# EAGLE design Schematic (EAGLE 6.3)
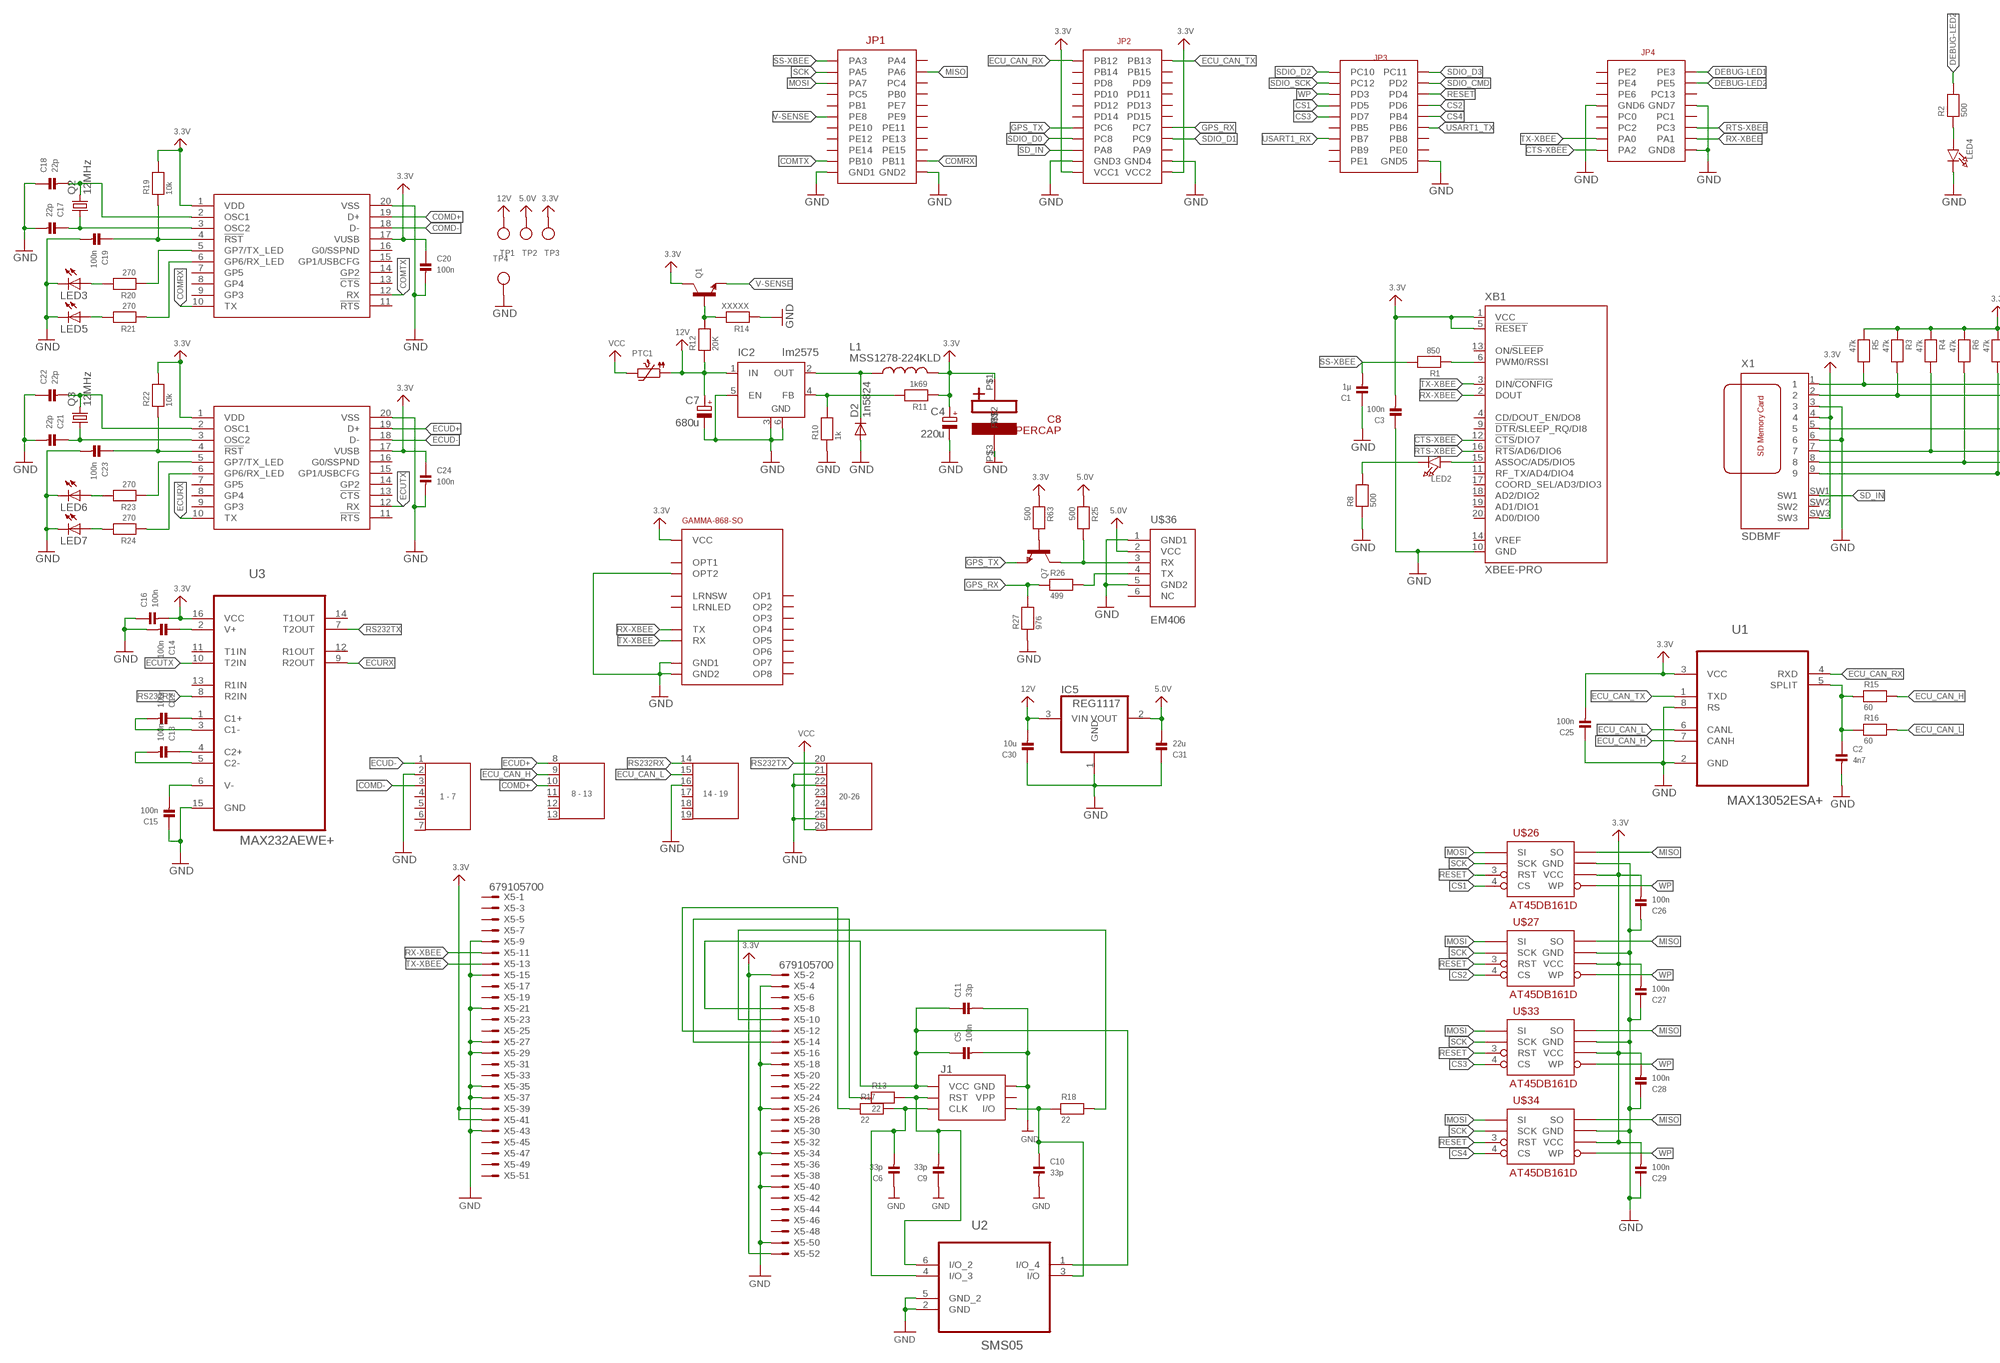
[diagram p0: schematic, sheet 1, part 1 of 2]
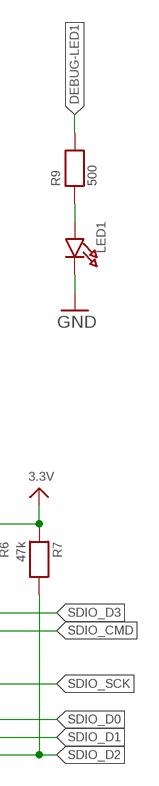
[diagram p1: schematic, sheet 1, part 2 of 2]

## Parts
C1  1µ  CAP_CERAMIC_0805  [_0805]
C2  4n7  CAP_CERAMIC0603  [0603]
C3  100n  CAP_CERAMIC_0603  [_0603]
C4  220u  CPOL-EUE3.5-8  [E3,5-8]
C5  100n  CAP_CERAMIC_0603  [_0603]
C6  33p  CAP_CERAMIC_0603  [_0603]
C7  680u  CPOL-EUE5-10.5  [E5-10,5]
C8  SUPERCAP  [SUPERCAP]
C9  33p  CAP_CERAMIC_0603  [_0603]
C10  33p  CAP_CERAMIC_0603  [_0603]
C11  33p  CAP_CERAMIC_0603  [_0603]
C12  100n  CAP_CERAMIC_0603  [_0603]
C13  100n  CAP_CERAMIC_0603  [_0603]
C14  100n  CAP_CERAMIC_0603  [_0603]
C15  100n  CAP_CERAMIC_0603  [_0603]
C16  100n  CAP_CERAMIC_0603  [_0603]
C17  22p  CAP_CERAMIC_0603  [_0603]
C18  22p  CAP_CERAMIC_0603  [_0603]
C19  100n  CAP_CERAMIC_0603  [_0603]
C20  100n  CAP_CERAMIC_0603  [_0603]
C21  22p  CAP_CERAMIC_0603  [_0603]
C22  22p  CAP_CERAMIC_0603  [_0603]
C23  100n  CAP_CERAMIC_0603  [_0603]
C24  100n  CAP_CERAMIC_0603  [_0603]
C25  100n  CAP_CERAMIC_0603  [_0603]
C26  100n  CAP_CERAMIC_0603  [_0603]
C27  100n  CAP_CERAMIC_0603  [_0603]
C28  100n  CAP_CERAMIC_0603  [_0603]
C29  100n  CAP_CERAMIC_0603  [_0603]
C30  10u  CAP_CERAMIC_0805  [_0805]
C31  22u  CAP_CERAMIC_0805  [_0805]
D2  1n5824  1N5400  [DO201-15]
IC2  lm2575  LM2596S  [TO263-5]
IC5  REG1117  [SOT223]
J1  SIMHOLDERSIM  [SIMHOLDER]
L1  MSS1278-224KLD  INDUCTORPWR  [CDRH125]
LED1  LED1206  [CHIPLED_1206]
LED2  LED1206  [CHIPLED_1206]
LED3  LEDCHIPLED_0805  [CHIPLED_0805]
LED4  LED1206  [CHIPLED_1206]
LED5  LEDCHIPLED_0805  [CHIPLED_0805]
LED6  LEDCHIPLED_0805  [CHIPLED_0805]
LED7  LEDCHIPLED_0805  [CHIPLED_0805]
PTC1  PTC1812  [PTC1812]
Q1  TRANSISTOR_NPNWIDE  [SOT23-WIDE]
Q2  12MHz  CRYSTALHC49S  [HC49/S]
Q3  12MHz  CRYSTALHC49S  [HC49/S]
Q7  TRANSISTOR_NPNWIDE  [SOT23-WIDE]
R1  850  RESISTOR_0603  [_0603]
R2  500  RESISTOR_0603  [_0603]
R3  47k  RESISTOR_0603  [_0603]
R4  47k  RESISTOR_0603  [_0603]
R5  47k  RESISTOR_0603  [_0603]
R6  47k  RESISTOR_0603  [_0603]
R7  47k  RESISTOR_0603  [_0603]
R8  500  RESISTOR_0603  [_0603]
R9  500  RESISTOR_0603  [_0603]
R10  1k  RESISTOR_0603  [_0603]
R11  1k69  RESISTOR_0603  [_0603]
R12  20K  RESISTOR_0603  [_0603]
R13  22  RESISTOR_0603  [_0603]
R14  XXXXX  RESISTOR_0603  [_0603]
R15  60  RESISTOR_0603  [_0603]
R16  60  RESISTOR_0603  [_0603]
R17  22  RESISTOR_0603  [_0603]
R18  22  RESISTOR_0603  [_0603]
R19  10k  RESISTOR_0603  [_0603]
R20  270  RESISTOR_0603  [_0603]
R21  270  RESISTOR_0603  [_0603]
R22  10k  RESISTOR_0603  [_0603]
R23  270  RESISTOR_0603  [_0603]
R24  270  RESISTOR_0603  [_0603]
R25  500  RESISTOR_0603  [_0603]
R26  499  RESISTOR_0603  [_0603]
R27  976  RESISTOR_0603  [_0603]
R63  500  RESISTOR_0603  [_0603]
TP1  TESTPOINT  [TESTPOINT_SMT]
TP2  TESTPOINT  [TESTPOINT_SMT]
TP3  TESTPOINT  [TESTPOINT_SMT]
TP4  TESTPOINT  [TESTPOINT_SMT]
U1  MAX13052ESA+  [SOIC127P600X175-8N]
U2  SMS05  [SOT95P280X145-6N]
U3  MAX232AEWE+  [SOIC127P1032X265-16N]
U$1  CPU-BOARD  [CPU-BOARD-JP1]
U$18  SUPERSEAL-26  [SUPERSEAL-26]
U$24  MCP2200  [SO20L]
U$26  AT45DB161D  [SO08-EIAJ]
U$27  AT45DB161D  [SO08-EIAJ]
U$29  MCP2200  [SO20L]
U$32  GAMMA-868-SO  [UNICORN_V2_GAMMA-868-SO]
U$33  AT45DB161D  [SO08-EIAJ]
U$34  AT45DB161D  [SO08-EIAJ]
U$36  EM406  [EM406]
X1  SDBMF  [SDBMF-009XXBXX2]
X5  679105700  [679105700]
XB1  XBEE-PRO  [XBEE-PRO]

## Nets
3.3V: C3.2 C4.+ C8.P$1 C16.2 C20.1 C24.1 C25.2 C26.2 C27.2 C28.2 C29.2 L1.2 Q1.3(C) R3.1 R4.1 R5.1 R6.1 R7.1 R11.1 R19.2 R22.2 R63.1 TP3.P$1 U1.3(VCC) U3.16(VCC) U$1.P$43(VCC1) U$1.P$44(VCC2) U$24.1(VDD) U$24.17(VUSB) U$26.6(VCC) U$27.6(VCC) U$29.1(VDD) U$29.17(VUSB) U$32.P$16(VCC) U$33.6(VCC) U$34.6(VCC) X1.4 X1.SW3 X5.2 X5.39 X5.41 X5.52 XB1.1(VCC) XB1.5(!RESET)
5.0V: C31.2 IC5.2(VOUT) R25.1 TP2.P$1 U$36.2(VCC)
12V: C7.+ C30.2 IC2.1(IN) IC5.3(VIN) PTC1.P$1 R12.1 TP1.P$1
COMD+: U$18.10 U$24.19(D+)
COMD-: U$18.3 U$24.18(D-)
COMRX: U$1.P$22(PB11) U$24.10(TX)
COMTX: U$1.P$21(PB10) U$24.12(RX)
CS1: U$1.P$51(PD5) U$26.4(CS)
CS2: U$1.P$52(PD6) U$27.4(CS)
CS3: U$1.P$53(PD7) U$33.4(CS)
CS4: U$1.P$54(PB4) U$34.4(CS)
CTS-XBEE: U$1.P$77(PA2) XB1.12(!CTS!/DIO7)
DEBUG-LED1: R9.2 U$1.P$64(PE3)
DEBUG-LED2: R2.2 U$1.P$66(PE5)
ECU_CAN_H: R15.2 U1.7(CANH) U$18.9
ECU_CAN_L: R16.2 U1.6(CANL) U$18.15
ECU_CAN_RX: U1.4(RXD) U$1.P$23(PB12)
ECU_CAN_TX: U1.1(TXD) U$1.P$24(PB13)
ECUD+: U$18.8 U$29.19(D+)
ECUD-: U$18.1 U$29.18(D-)
ECURX: U3.9(R2OUT) U$29.10(TX)
ECUTX: U3.10(T2IN) U$29.12(RX)
GND: C1.1 C2.2 C3.1 C4.- C5.2 C6.1 C7.- C8.P$3 C9.1 C10.2 C11.2 C14.2 C15.1 C16.1 C17.2 C18.1 C19.2 C20.2 C21.2 C22.1 C23.2 C24.2 C25.1 C26.1 C27.1 C28.1 C29.1 C30.1 C31.1 D2.A IC2.3(GND) IC2.5(EN) IC2.6(GND) IC5.1(GND) J1.C5(GND) LED1.C LED3.C LED4.C LED5.C LED6.C LED7.C R8.1 R10.1 R14.1 R27.1 TP4.P$1 U1.2(GND) U1.8(RS) U2.2(GND) U2.5(GND_2) U3.15(GND) U$1.P$19(GND1) U$1.P$20(GND2) U$1.P$41(GND3) U$1.P$42(GND4) U$1.P$62(GND5) U$1.P$69(GND6) U$1.P$70(GND7) U$1.P$78(GND8) U$18.2 U$18.16 U$18.21 U$18.22 U$18.25 U$24.20(VSS) U$26.7(GND) U$27.7(GND) U$29.20(VSS) U$32.P$2(GND1) U$32.P$14(OPT2) U$32.P$15(GND2) U$33.7(GND) U$34.7(GND) U$36.1(GND1) U$36.5(GND2) X1.3 X1.6 X5.4 X5.9 X5.15 X5.18 X5.21 X5.26 X5.27 X5.29 X5.34 X5.35 X5.37 X5.40 X5.43 X5.50 XB1.10(GND)
GPS_RX: R26.1 R27.2 U$1.P$36(PC7)
GPS_TX: Q7.2(E) U$1.P$35(PC6)
MISO: U$1.P$4(PA6) U$26.8(SO) U$27.8(SO) U$33.8(SO) U$34.8(SO)
MOSI: U$1.P$5(PA7) U$26.1(SI) U$27.1(SI) U$33.1(SI) U$34.1(SI)
N$1: IC2.4(FB) R10.2 R11.2
N$2: R1.1 XB1.6(PWM0/RSSI)
N$3: LED4.A R2.1
N$4: D2.C IC2.2(OUT) L1.1
N$5: LED2.A XB1.15(ASSOC/AD5/DIO5)
N$6: LED2.C R8.2
N$7: LED1.A R9.1
N$8: C13.1 U3.4(C2+)
N$9: C12.2 U3.3(C1-)
N$10: C12.1 U3.1(C1+)
N$13: C15.2 U3.6(V-)
N$14: Q1.1(B) R12.2 R14.2
N$15: C14.1 U3.2(V+)
N$16: C9.2 J1.C2(RST) R13.2 U2.6(I/O_2)
N$17: C6.2 J1.C3(CLK) R17.2 U2.4(I/O_3)
N$18: C10.1 J1.C7(I/O) R18.1 U2.3(I/O)
N$19: C5.1 C11.1 J1.C1(VCC) U2.1(I/O_4) X5.8
N$20: C13.2 U3.5(C2-)
N$21: C2.1 R15.1 R16.1 U1.5(SPLIT)
N$22: R18.2 X5.10
N$23: R13.1 X5.14
N$24: R17.1 X5.12
N$25: C22.2 Q3.2 U$29.2(OSC1)
N$26: C18.2 Q2.2 U$24.2(OSC1)
N$27: C17.1 Q2.1 U$24.3(OSC2)
N$28: C21.1 Q3.1 U$29.3(OSC2)
N$29: R21.1 U$24.6(GP6/RX_LED)
N$36: R20.1 U$24.5(GP7/TX_LED)
N$43: C19.1 R19.1 U$24.4(!RST)
N$44: R24.1 U$29.6(GP6/RX_LED)
N$45: R23.1 U$29.5(GP7/TX_LED)
N$46: LED3.A R20.2
N$47: LED5.A R21.2
N$48: C23.1 R22.1 U$29.4(!RST)
N$55: LED6.A R23.2
N$56: LED7.A R24.2
N$58: Q7.1(B) R63.2
RESET: U$1.P$50(PD4) U$26.3(RST) U$27.3(RST) U$33.3(RST) U$34.3(RST)
RS232RX: U3.8(R2IN) U$18.14
RS232TX: U3.7(T2OUT) U$18.20
RTS-XBEE: U$1.P$74(PC3) XB1.16(!RTS!/AD6/DIO6)
RX-XBEE: U$1.P$76(PA1) U$32.P$17(TX) X5.11 XB1.2(DOUT)
RXD1: R26.2 U$36.4(TX)
SCK: U$1.P$3(PA5) U$26.2(SCK) U$27.2(SCK) U$33.2(SCK) U$34.2(SCK)
SD_IN: U$1.P$39(PA8) X1.SW1
SDIO_CMD: R3.2 U$1.P$48(PD2) X1.2
SDIO_D0: R4.2 U$1.P$37(PC8) X1.7
SDIO_D1: R6.2 U$1.P$38(PC9) X1.8
SDIO_D2: R7.2 U$1.P$45(PC10) X1.9
SDIO_D3: R5.2 U$1.P$46(PC11) X1.1
SDIO_SCK: U$1.P$47(PC12) X1.5
SS-XBEE: C1.2 R1.2 U$1.P$1(PA3)
TX-XBEE: U$1.P$75(PA0) U$32.P$18(RX) X5.13 XB1.3(DIN/!CONFIG)
TXD1: Q7.3(C) R25.2 U$36.3(RX)
USART1_RX: U$1.P$57(PB7)
USART1_TX: U$1.P$56(PB6)
V-SENSE: Q1.2(E) U$1.P$11(PE8)
VCC: PTC1.P$2 U$18.26
WP: U$1.P$49(PD3) U$26.5(WP) U$27.5(WP) U$33.5(WP) U$34.5(WP)
Unconnected: J1.C6(VPP) U3.11(T1IN) U3.12(R1OUT) U3.13(R1IN) U3.14(T1OUT) U$1.P$2(PA4) U$1.P$6(PC4) U$1.P$7(PC5) U$1.P$8(PB0) U$1.P$9(PB1) U$1.P$10(PE7) U$1.P$12(PE9) U$1.P$13(PE10) U$1.P$14(PE11) U$1.P$15(PE12) U$1.P$16(PE13) U$1.P$17(PE14) U$1.P$18(PE15) U$1.P$25(PB14) U$1.P$26(PB15) U$1.P$27(PD8) U$1.P$28(PD9) U$1.P$29(PD10) U$1.P$30(PD11) U$1.P$31(PD12) U$1.P$32(PD13) U$1.P$33(PD14) U$1.P$34(PD15) U$1.P$40(PA9) U$1.P$55(PB5) U$1.P$58(PB8) U$1.P$59(PB9) U$1.P$60(PE0) U$1.P$61(PE1) U$1.P$63(PE2) U$1.P$65(PE4) U$1.P$67(PE6) U$1.P$68(PC13) U$1.P$71(PC0) U$1.P$72(PC1) U$1.P$73(PC2) U$18.4 U$18.5 U$18.6 U$18.7 U$18.11 U$18.12 U$18.13 U$18.17 U$18.18 U$18.19 U$18.23 U$18.24 U$24.7(GP5) U$24.8(GP4) U$24.9(GP3) U$24.11(!RTS) U$24.13(!CTS) U$24.14(GP2) U$24.15(GP1/USBCFG) U$24.16(G0/SSPND) U$29.7(GP5) U$29.8(GP4) U$29.9(GP3) U$29.11(!RTS) U$29.13(!CTS) U$29.14(GP2) U$29.15(GP1/USBCFG) U$29.16(G0/SSPND) U$32.P$3(OP1) U$32.P$4(OP2) U$32.P$5(LRNSW) U$32.P$6(LRNLED) U$32.P$7(OP3) U$32.P$8(OP4) U$32.P$9(OP5) U$32.P$10(OPT1) U$32.P$11(OP6) U$32.P$12(OP7) U$32.P$13(OP8) U$36.6(NC) X1.SW2 X5.1 X5.3 X5.5 X5.6 X5.7 X5.16 X5.17 X5.19 X5.20 X5.22 X5.23 X5.24 X5.25 X5.28 X5.30 X5.31 X5.32 X5.33 X5.36 X5.38 X5.42 X5.44 X5.45 X5.46 X5.47 X5.48 X5.49 X5.51 XB1.4(CD/DOUT_EN/DO8) XB1.9(!DTR!/SLEEP_RQ/DI8) XB1.11(RF_TX/AD4/DIO4) XB1.13(ON/!SLEEP) XB1.14(VREF) XB1.17(COORD_SEL/AD3/DIO3) XB1.18(AD2/DIO2) XB1.19(AD1/DIO1) XB1.20(AD0/DIO0)

## Library data of the parts
C1-C3 C5 C6 C9-C31 = microbuilder:CAP_CERAMIC: Ceramic Capacitors 0402 - 0402 Surface Mount Capacitors 16pF 50V 5% [Digikey: 445-4899-2-ND] 18pF 50V 5% [Digikey: 490-1281-2-ND] 22pF 50V 5% [Digikey: 490-1283-2-ND] 68pF 50V 5% [Digikey: 490-1289-2-ND] 0.1uF 10V 10% [Digikey: 490-1318-2-ND] 1.0uF 6.3V 10% [Digikey: 490-1320-2-ND] 0603 - 0603 Surface Mount Capacitors 16 pF 50V 5% [Digikey: 445-5051-2-ND] 22 pF 50V [Digikey: PCC220ACVTR-ND] 33 pF 50V 5% [Digikey: 490-1415-1-ND] 56pF 50V 5% [Digikey: 490-1421-1-ND] 220pF 50V 5% [Digikey: 445-1285-1-ND] 680 pF 50V 2200 pF 50V 5% C0G [Digikey: 445-1297-1-ND] 5600 pF 100V 5% X7R [Digikey: 478-3711-1-ND] 0.1 µF 25V 10% [Digikey: PCC2277TR-ND] 0.22 µF 16V 10% X7R [Digikey: 445-1318-1-ND] 1.0 µF 25V 10% [Digikey: 445-5146-2-ND] 0603 - RF Specific 3pF 250V +/-0.1pF RF [Digikey: 712-1347-1-ND] 18 pF 250V 5% [Digikey: 478-3505-1-ND or 712-1322-1-ND] 56 pF 250V 5% C0G RF [Digikey: 490-4867-1-ND] 68 pF 250V RF [Digikey: 490-4868-1-ND] 0805 - 0805 Surface Mount Capacitors 220 pF 250V 2% RF Ceramic Capacitor [Digikey: 712-1398-1-ND] 1000 pF 50V 2% NP0 Ceramic Capacitor [Digikey: 478-3760-1-ND] 0.1 µF 25V 10% Ceramic Capacitor [Digikey: PCC1828TR-ND] 1.0 µF 16V 10% Ceramic Capacitor[Digikey: 490-1691-2-ND] 10.0 µF 10V 10% Ceramic Capacitor[Digikey: 709-1228-1-ND] 10.0 uF 16V 10% Ceramic Capacitor [Digikey: 478-5165-2-ND] 47 uF 6.3V 20% Ceramic Capacitor [Digikey: 587-1779-1-ND or 399-5506-1-ND] 1206 - 1206 Surface Mount Capacitors 47uF 10V 20% Ceramic Capacitor [Digikey: 490-5528-1-ND or 399-5508-1-ND or 445-6010-1-ND] 100uF 6.3V -20%, +80% Y5V Ceramic Capacitor (Digikey: 490-4512-1-ND, Mouser: 81-GRM31CF50J107ZE1L)
C4 C7 = rcl:CPOL-EU: POLARIZED CAPACITOR, European symbol
C8 = unicorn_v2:SUPERCAP
D2 = diode:1N5400: DIODE standard rectifier, 3 A, 50 V (Motorola)
IC2 = linear:LM2596S: STEP-DOWN VOLTAGE REGULATOR
IC5 = burr-brown:REG1117: 800mA and 1A Low Dropout (LDO) Positive Regulator 1.8V, 2.5V, 2.85V, 3.3V, 5V, and Adj; MPN: REG1117; OC_FARNELL: 1097566; OC_NEWARK: 14P6981
J1 = SparkFun-Connectors:SIMHOLDER: SIM Socket Socket for SIM cellular cards. Schematic element and footprint production proven. Spark Fun Electronics SKU : PRT-00548; PROD_ID: CONN-08536
L1 = SparkFun-Passives:INDUCTOR: Inductors Basic Inductor/Choke - 0603 and 1206. Footprints are not proven and vary greatly between part numbers. INDUCTOR POWER 3.3UH 4.0A SMD 0.197" L x 0.197" W x 0.177" H (5.00mm x 5.00mm x 4.50mm)
LED1 LED2 LED4 = microbuilder:LED: LED
LED3 LED5-LED7 = adafruit:LED: LED
PTC1 = microbuilder:PTC: PTC (Resettable Fuse) 1206 Package 250mA PTC (16V Max, Time-to-Trip: 0.08s) - Digikey: F2110CT-ND 1210 Package 100mA PTC (30V Max, Time-to-Trip: 0.6s) - Digikey: MF-USMF010-2CT-ND 1812 Package 750mA PTC (24V Max, Time-to-Trip: 0.2s) - Digikey: MF-MSMF075/24-2CT-ND
Q1 Q7 = microbuilder:TRANSISTOR_NPN: NPN Transistor Transistor (NPN) 500mA 45V - BC817 [Digikey: 568-1631-1-ND] Transistor (NPN) 500mA 45V - BC817,215 [Mouser: 771-BC817-T/R] SOT23-R - SOT23 footprint optimised for use with solder paste and reflow ovens. SOT23-W - SOT23 footprint optimised for hand-soldering (larger pads).
Q2 Q3 = adafruit:CRYSTAL: CRYSTAL; OC_FARNELL: 1667008; OC_NEWARK: unknown
R1-R27 R63 = microbuilder:RESISTOR: Resistors 0402 - 0402 Surface Mount Package 22 Ohm 1% 1/16W [Digikey: 311-22.0LRTR-ND] 33 Ohm 5% 1/16W 1.0K 5% 1/16W 1.5K 5% 1/16W 2.0K 1% 1/16W 10.0K 1% 1/16W [Digikey: 311-10.0KLRTR-ND] 10.0K 5% 1/16W [Digikey: RMCF0402JT10K0TR-ND] 12.1K 1% 1/16W [Digikey: 311-22.0LRTR-ND] 100.0K 5% 1/16W 0603 - 0603 Surface Mount Package 0 Ohm 1/10 Watt 1% Resistor 15 Ohm 1/10 Watt 1% Resistor 33 Ohm 1/10 Watt 1% Resistor 49.9 Ohm 1/10 Watt 1% Resistor 100 Ohm 1/10 Watt 1% Resistor 150 Ohm 1/10 Watt 1% Resistor 240 Ohm 1/10 Watt 1% Resistor 390 Ohm 1/10 Watt 1% Resistor 560 Ohm 1/10 Watt 1% Resistor 680 Ohm 1/10 Watt 1% Resistor 750 Ohm 1/10 Watt 1% Resistor 1.0K Ohm 1/10 Watt 1% Resistor 1.5K Ohm 1/10 Watt 1% Resistor 2.0K Ohm 1/10 Watt 1% Resistor 2.2K Ohm 1/10 Watt 1% Resistor 3.3K Ohm 1/10 Watt 1% Resistor 4.7K Ohm 1/10 Watt 1% Resistor 10.0K Ohm 1/10 Watt 1% Resistor 12.0K Ohm 1/10 Watt 1% Resistor 12.1K Ohm 1/10 Watt 1% Resistor 20.0K Ohm 1/10 Watt 1% Resistor 33.0K Ohm 1/10 Watt 1% Resistor 100.0K Ohm 1/10 Watt 1% Resistor 0805 - 0805 Surface Mount Package 0 Ohm 1/8 Watt 1% Resistor 33 Ohm 1/8 Watt 1% Resistor 100 Ohm 1/8 Watt 1% Resistor 150 Ohm 1/8 Watt 1% Resistor 200 Ohm 1/8 Watt 1% Resistor 240 Ohm 1/8 Watt 1% Resistor 330 Ohm 1/8 Watt 1% Resistor 390 Ohm 1/8 Watt 1% Resistor 470 Ohm 1/8 Watt 1% Resistor 1.0K Ohm 1/8 Watt 1% Resistor 1.5K Ohm 1/8 Watt 1% Resistor 2.0K Ohm 1/8 Watt 1% Resistor 4.7K Ohm 1/8 Watt 1% Resistor 5.1K Ohm 1/8 Watt 1% Resistor 5.6K Ohm 1/8 Watt 1% Resistor 10.0K Ohm 1/8 Watt 1% Resistor 22.0K Ohm 1/8 Watt 1% Resistor 33.0K Ohm 1/8 Watt 1% Resistor 100K Ohm 1/8 Watt 1% Resistor 1206 - 1206 Surface Mount Package 2012 - 2010 Surface Mount Package 0.11 Ohm 1/2 Watt 1% Resistor - Digikey: RHM.11UCT-ND
TP1-TP4 = microbuilder:TESTPOINT: Test Point Various test points for characterisation and PCB testing TESTPOINT_SMT - Compact Surface Mount Test Point [Digikey: 5016KTR-ND]
U1 = Maxim_By_element14_Batch_1:MAX13052ESA+: Industry-Standard High-Speed CAN Transceivers with ±80V Fault Protection; MPN: MAX13052ESA+; OC_FARNELL: 1600112; OC_NEWARK: 99K2875; PACKAGE: SOIC-8; SUPPLIER: Maxim
U2 = SMS05:SMS05: TVS DIODE; MPN: SMS05; OC_FARNELL: 2059036; OC_NEWARK: 64T4092; PACKAGE: SOT-23-6; SUPPLIER: SEMTECH
U3 = Maxim_By_element14_Batch_1:MAX232AEWE+: +5V-Powered, Multichannel RS-232 Drivers/Receivers; MPN: MAX232AEWE+; OC_FARNELL: 9724400; OC_NEWARK: 67K4435; PACKAGE: SOIC-16; SUPPLIER: Maxim
U$1 = unicorn_v2:CPU-BOARD
U$18 = AAU-Racing:SUPERSEAL-26
U$24 U$29 = mcp2200:MCP2200: USB to serial converter by micreochip
U$26 U$27 U$33 U$34 = SparkFun-DigitalIC:AT45DB161D: 16-Mbit SPI flash memory
U$32 = unicorn_v2:GAMMA-868-SO
U$36 = SparkFun:EM406: EM406 Connector Proven layout and schematic for EM406 connector. Spark Fun Electronics SKU : GPS-00579
X1 = farnell:SDBMF: SD MEMORY CARD PUSH-PUSH WITH CONNECTOR TYPE B (BIG SWUÌTCH #3) KINGFONT PRECISION INDUSTIAL CO., LTD Source: http://www.farnell.com/datasheets/74273.pdf Best.-Nr.: 9186174 Hersteller: MULTICOMP Herstellerbez.: SDBMF-00915B0T2
X5 = con-molex:679105700: MINI PCI EXPRESS CONNECTOR 0.8MM PITCH, 52 CIRCUIT Source: http://www.molex.com/pdm_docs/sd/679105700_sd.pdf; MPN: 67910-5700; OC_FARNELL: unknown; OC_NEWARK: 93M2128
XB1 = maxstream:XBEE: XBee (TM) /XBee-PRO(TM) OEM RF Modules Source: MaxStream, Inc. xbee_productmanual.pdf; MPN: XBP24-AWI-001; OC_FARNELL: 1337916; OC_NEWARK: 42M2667

## Board
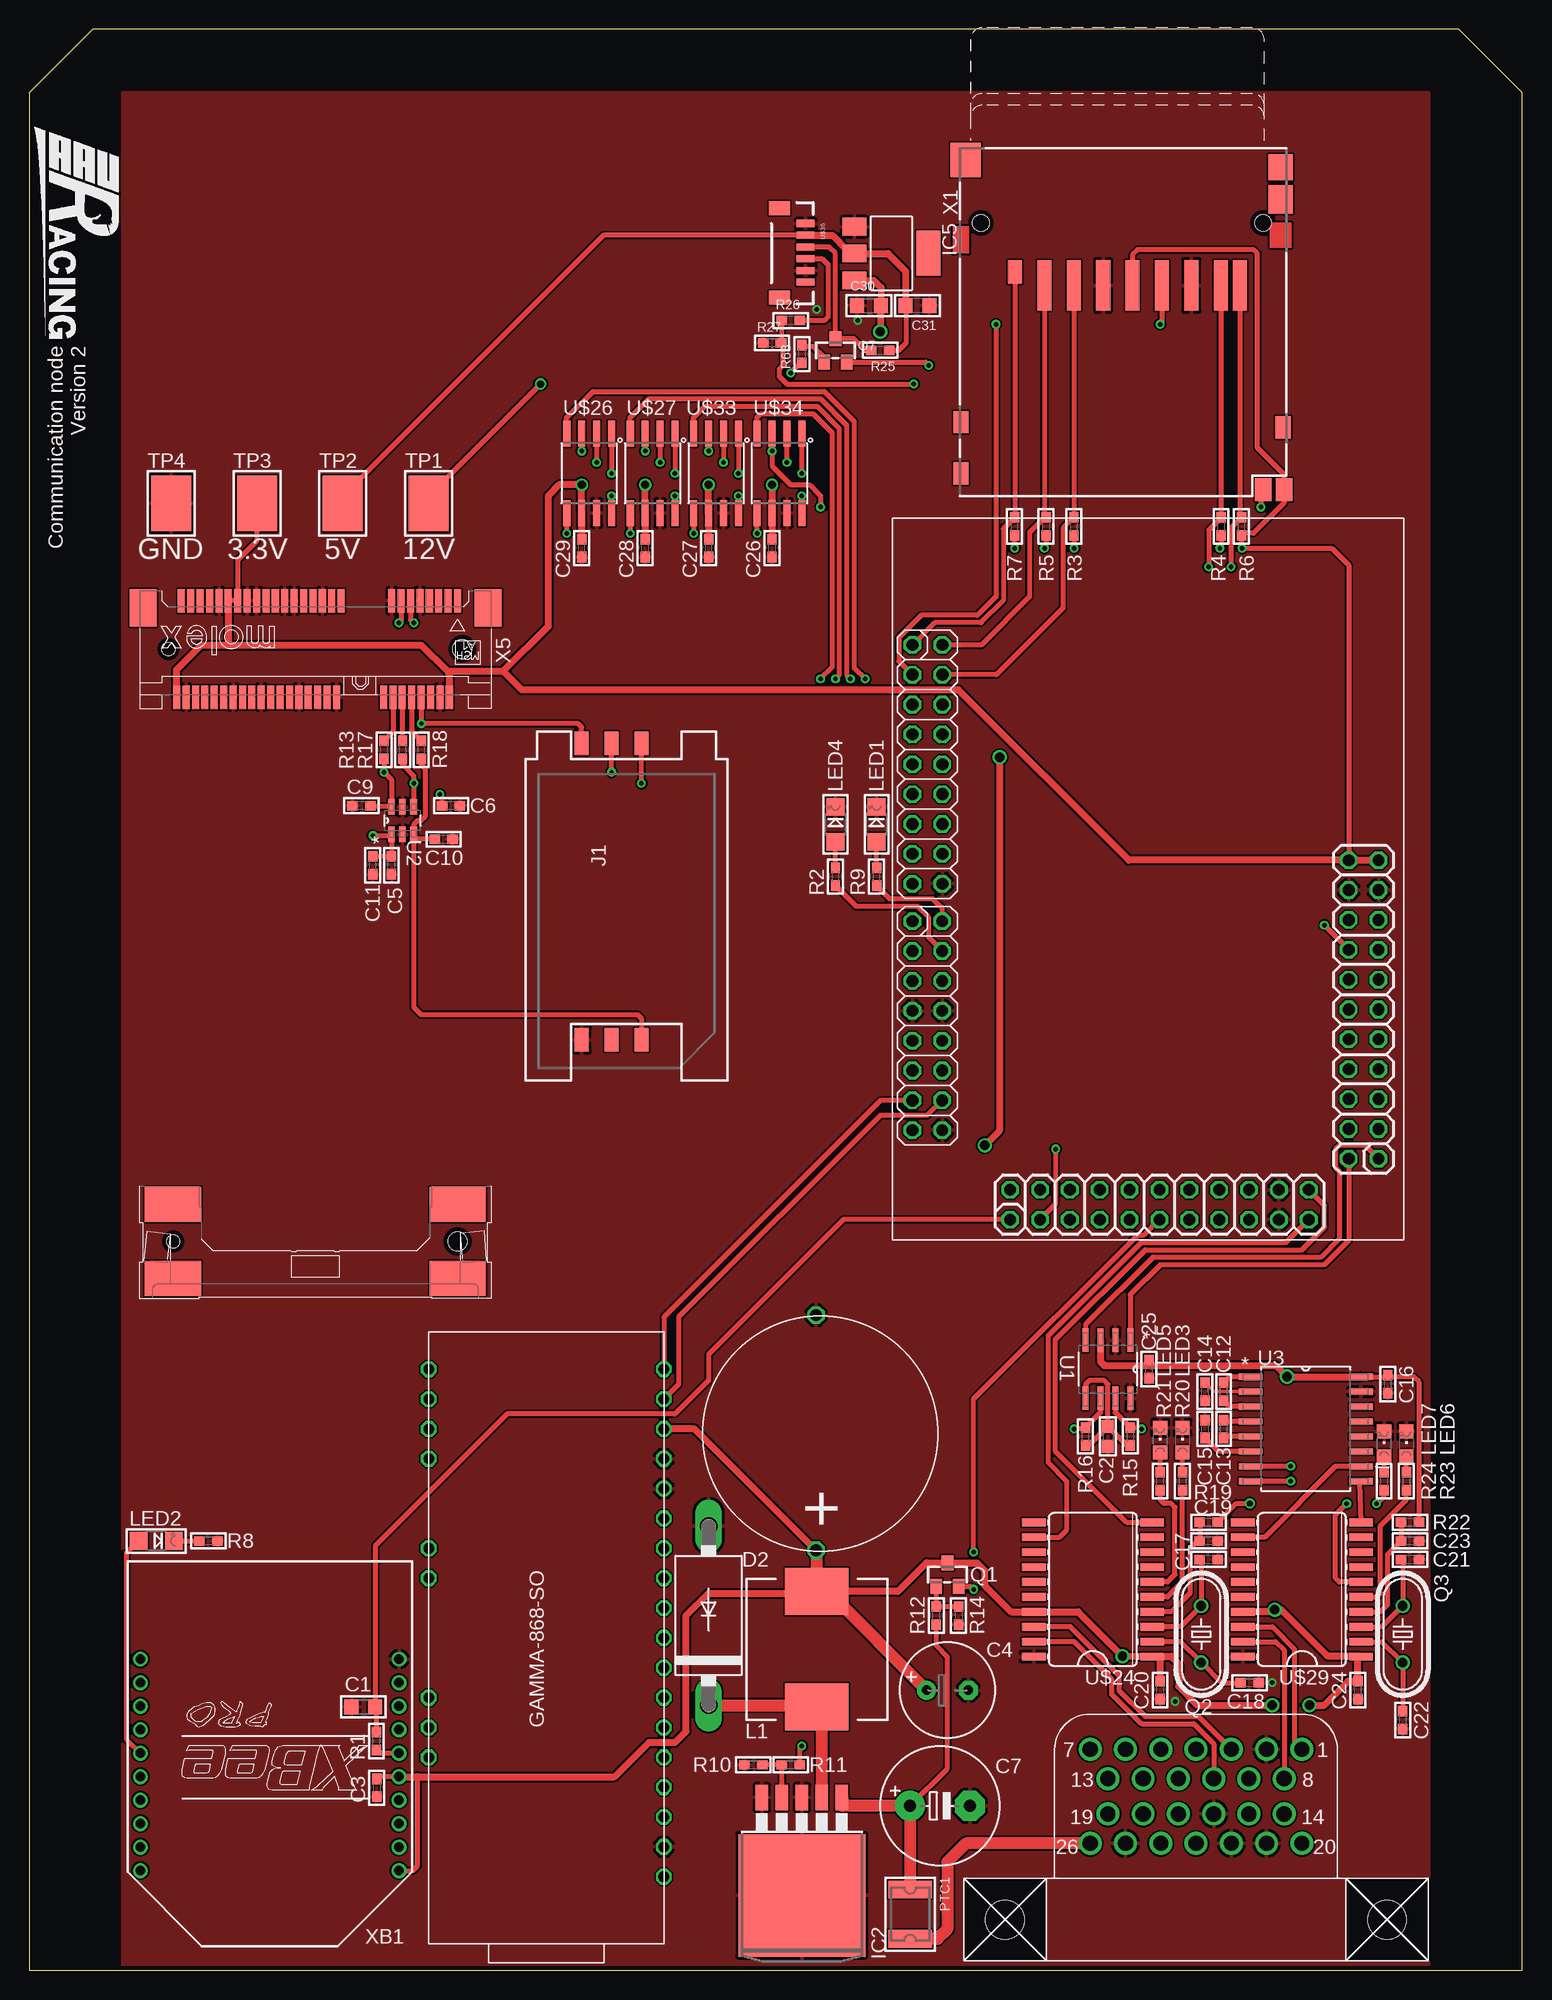
[diagram p2: board, top side]
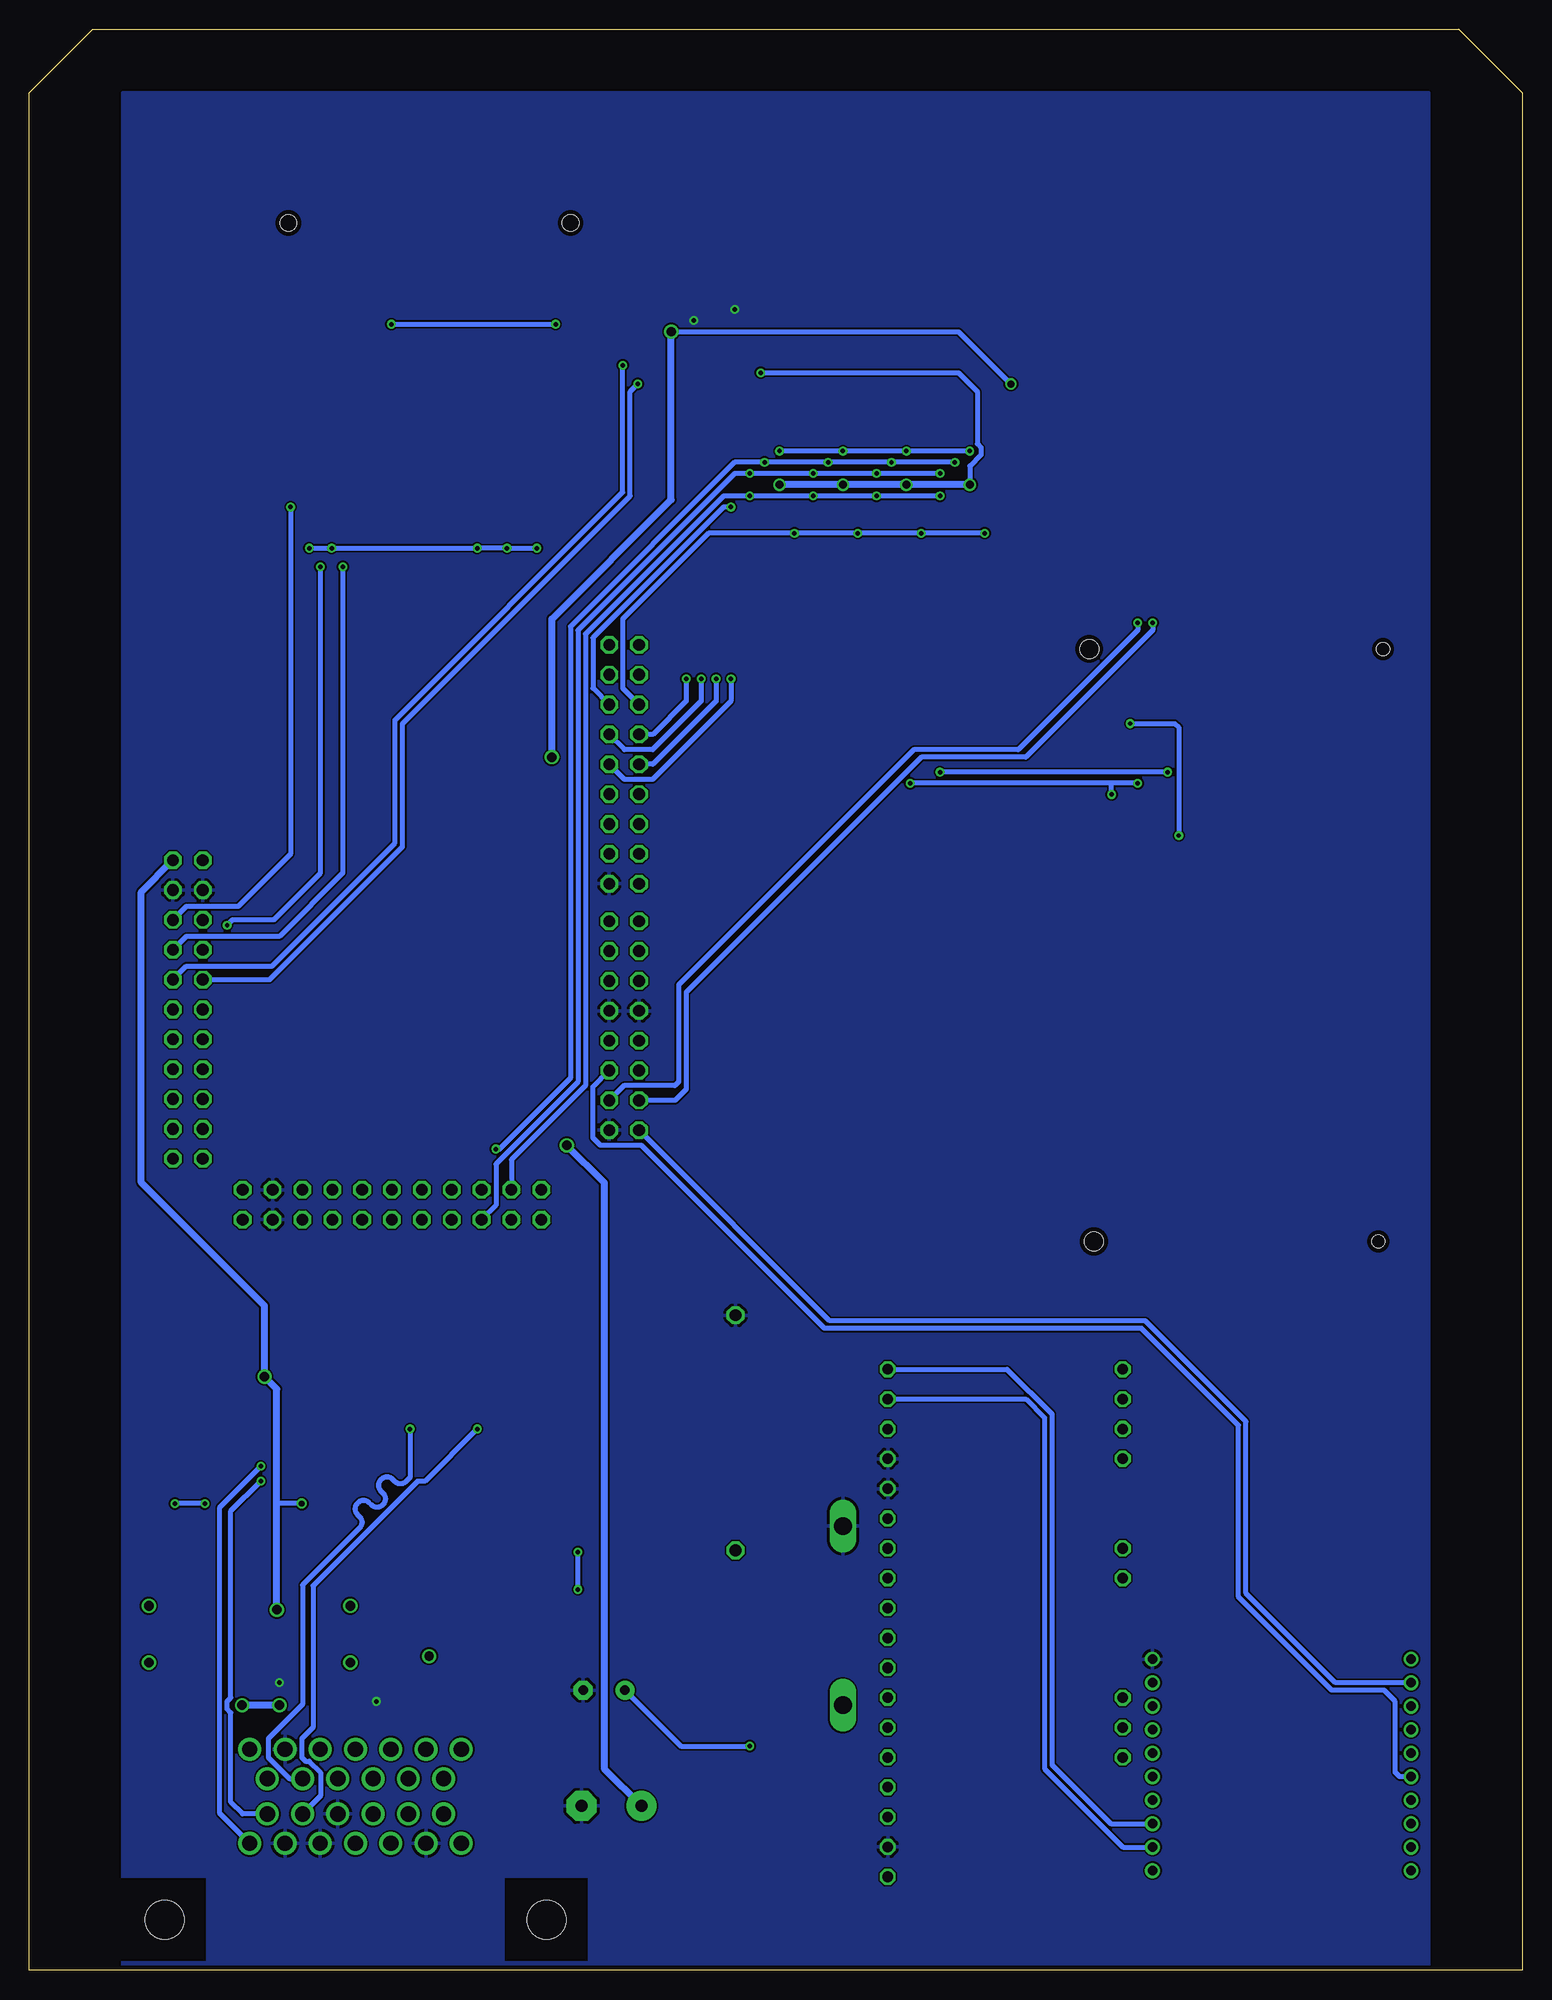
[diagram p3: board, bottom side, seen from below]

Size 127 x 165.1 mm. Coordinates in mm from the lower left corner, seen from the top.
Outline: 127,0 127,159.7 121.6,165.1 5.4,165.1 0,159.7 0,0 127,0
Copper layers (1*16): Top 0.0356mm / dielectric 1.5011mm / Bottom 0.0356mm
Design rules "LaenPCBOrder": minimum track width 6mil, minimum drill 13mil, track to track 6mil, track to pad 6mil, pad to pad 6mil, via to via 6mil, smd to smd 6mil, copper to edge 15mil, drill to drill 6mil, minimum pad ring 7mil, minimum via ring 7mil, stop-mask expansion 3mil, vias tented up to drill 0mil, thermal gap 10mil

### Footprints (pad centres in the part's own frame; a part is rotated, then mirrored left to right if it is on the bottom)
_0805 = smd 1.2 x 1.3: 1 -1.016,0; 2 1.016,0
0603 = smd 1.1 x 1: 1 -0.85,0; 2 0.85,0
_0603 = smd 0.9 x 0.8: 1 -0.762,0; 2 0.762,0
E3,5-8 = drill 0.813 pad 1.6: + -1.778,0 | drill 0.813 pad 1.6 octagon: - 1.778,0
E5-10,5 = drill 1.016 pad 2.54: + -2.54,0 | drill 1.016 pad 2.54 octagon: - 2.54,0
SUPERCAP = drill 1 octagon: P$1 -9.93,0.35; P$3 10.07,0.35
DO201-15 = drill 1.499 long: A 7.62,0; C -7.62,0
TO263-5 = smd 1.067 x 2.159: 1 -3.404,-5.791; 2 -1.702,-5.791; 3 0,-5.791; 4 1.702,-5.791; 5 3.404,-5.791 | smd 10.8 x 10.41: 6 0,2.54
SOT223 = smd 1.499 x 2.007: 1 -2.261,-3.15; 2 0.025,-3.15; 3 2.311,-3.15 | smd 3.81 x 2.007: 4 0,3.15
SIMHOLDER = smd 2 x 1.2: C1 -12.61,-3.81; C2 -12.61,-1.27; C3 -12.61,1.27; C5 12.61,-3.81; C6 12.61,-1.27; C7 12.61,1.27
CDRH125 = smd 5.4 x 4: 1 0,4.9; 2 0,-4.9
CHIPLED_1206 = smd 1.5 x 1.5: A 0,-1.496; C 0,1.496
CHIPLED_0805 = smd 1.2 x 1.2: A 0,-1.05; C 0,1.05
PTC1812 = smd 1.5 x 3.7: P$1 -2.1,0; P$2 2.1,0
SOT23-WIDE = smd 1 x 1.27: 1 -0.95,-1; 2 0.95,-1; 3 0,1
HC49/S = drill 0.813: 1 -2.413,0; 2 2.413,0
TESTPOINT_SMT = smd 4.7 x 3.4: P$1 0,0
SOIC127P600X175-8N = smd 1.981 x 0.533: 1 -2.464,1.905; 2 -2.464,0.635; 3 -2.464,-0.635; 4 -2.464,-1.905; 5 2.464,-1.905; 6 2.464,-0.635; 7 2.464,0.635; 8 2.464,1.905
SOT95P280X145-6N = smd 1.321 x 0.559: 1 -1.168,0.94; 2 -1.168,0; 3 -1.168,-0.94; 4 1.168,-0.94; 5 1.168,0; 6 1.168,0.94
SOIC127P1032X265-16N = smd 1.981 x 0.533: 1 -4.699,4.445; 2 -4.699,3.175; 3 -4.699,1.905; 4 -4.699,0.635; 5 -4.699,-0.635; 6 -4.699,-1.905; 7 -4.699,-3.175; 8 -4.699,-4.445; 9 4.699,-4.445; 10 4.699,-3.175; 11 4.699,-1.905; 12 4.699,-0.635; 13 4.699,0.635; 14 4.699,1.905; 15 4.699,3.175; 16 4.699,4.445
CPU-BOARD-JP1 = drill 1 octagon: P$1 1.27,-12.7; P$2 -1.27,-12.7; P$3 1.27,-10.16; P$4 -1.27,-10.16; P$5 1.27,-7.62; P$6 -1.27,-7.62; P$7 1.27,-5.08; P$8 -1.27,-5.08; P$9 1.27,-2.54; P$10 -1.27,-2.54; P$11 1.27,0; P$12 -1.27,0; P$13 1.27,2.54; P$14 -1.27,2.54; P$15 1.27,5.08; P$16 -1.27,5.08; P$17 1.27,7.62; P$18 -1.27,7.62; P$19 1.27,10.16; P$20 -1.27,10.16; P$21 1.27,12.7; P$22 -1.27,12.7; P$23 -3.905,18.637; P$24 -3.905,16.097; P$25 -6.445,18.637; P$26 -6.445,16.097; P$27 -8.985,18.637; P$28 -8.985,16.097; P$29 -11.525,18.637; P$30 -11.525,16.097; P$31 -14.065,18.637; P$32 -14.065,16.097; P$33 -16.605,18.637; P$34 -16.605,16.097; P$35 -19.145,18.637; P$36 -19.145,16.097; P$37 -21.685,18.637; P$38 -21.685,16.097; P$39 -24.225,18.637; P$40 -24.225,16.097; P$41 -26.765,18.637; P$42 -26.765,16.097; P$43 -29.305,18.637; P$44 -29.305,16.097; P$45 -47.625,-21.018; P$46 -47.625,-18.479; P$47 -45.085,-21.018; P$48 -45.085,-18.479; P$49 -42.545,-21.018; P$50 -42.545,-18.479; P$51 -40.005,-21.018; P$52 -40.005,-18.479; P$53 -37.465,-21.018; P$54 -37.465,-18.479; P$55 -34.925,-21.018; P$56 -34.925,-18.479; P$57 -32.385,-21.018; P$58 -32.385,-18.479; P$59 -29.845,-21.018; P$60 -29.845,-18.479; P$61 -27.305,-21.018; P$62 -27.305,-18.479; P$63 -24.115,-21.024; P$64 -24.115,-18.484; P$65 -21.575,-21.024; P$66 -21.575,-18.484; P$67 -19.035,-21.024; P$68 -19.035,-18.484; P$69 -16.495,-21.024; P$70 -16.495,-18.484; P$71 -13.955,-21.024; P$72 -13.955,-18.484; P$73 -11.415,-21.024; P$74 -11.415,-18.484; P$75 -8.875,-21.024; P$76 -8.875,-18.484; P$77 -6.335,-21.024; P$78 -6.335,-18.484
SUPERSEAL-26 = drill 1.3: 1 8.88,14.66; 2 5.88,14.66; 3 2.88,14.66; 4 -0.12,14.66; 5 -3.12,14.66; 6 -6.12,14.66; 7 -9.12,14.66; 8 7.38,12.16; 9 4.38,12.16; 10 1.38,12.16; 11 -1.62,12.16; 12 -4.62,12.16; 13 -7.62,12.16; 14 7.38,9.16; 15 4.38,9.16; 16 1.38,9.16; 17 -1.62,9.16; 18 -4.62,9.16; 19 -7.62,9.16; 20 8.88,6.66; 21 5.88,6.66; 22 2.88,6.66; 23 -0.12,6.66; 24 -3.12,6.66; 25 -6.12,6.66; 26 -9.12,6.66 | hole 3.3: -16.37,0.17; 16.13,0.17
SO20L = smd 0.66 x 2.032: 1 -5.715,-5.029; 2 -4.445,-5.029; 3 -3.175,-5.029; 4 -1.905,-5.029; 5 -0.635,-5.029; 6 0.635,-5.029; 7 1.905,-5.029; 8 3.175,-5.029; 9 4.445,-5.029; 10 5.715,-5.029; 11 5.715,5.029; 12 4.445,5.029; 13 3.175,5.029; 14 1.905,5.029; 15 0.635,5.029; 16 -0.635,5.029; 17 -1.905,5.029; 18 -3.175,5.029; 19 -4.445,5.029; 20 -5.715,5.029
SO08-EIAJ = smd 0.61 x 2.21: 1 -1.905,-3.378; 2 -0.635,-3.378; 3 0.635,-3.378; 4 1.905,-3.378; 5 1.905,3.353; 6 0.635,3.353; 7 -0.635,3.353; 8 -1.905,3.353
UNICORN_V2_GAMMA-868-SO = drill 0.9 octagon: P$1 0,0; P$2 2.54,0; P$3 5.08,0; P$4 7.62,0; P$5 10.16,0; P$6 12.7,0; P$7 15.24,0; P$8 17.78,0; P$9 20.32,0; P$10 22.86,0; P$11 25.4,0; P$12 27.94,0; P$13 30.48,0; P$14 33.02,0; P$15 35.56,0; P$16 38.1,0; P$17 40.64,0; P$18 43.18,0; P$19 43.18,20.003; P$20 40.64,20.003; P$21 38.1,20.003; P$22 35.56,20.003; P$23 27.94,20.003; P$24 25.4,20.003; P$25 15.24,20.003; P$26 12.7,20.003; P$27 10.16,20.003
EM406 = smd 0.6 x 1.55: 1 0,0; 2 1,0; 3 2,0; 4 3,0; 5 4,0; 6 5,0 | smd 1.2 x 1.8: P$1 -1.3,-2.225; P$2 6.3,-2.225
SDBMF-009XXBXX2 = smd 1.2 x 4.3: 1 6.7,5.325; 2 4.2,5.325; 3 1.7,5.325; 4 -0.8,5.325; 5 -3.3,5.325; 6 -5.8,5.325; 7 -8.3,5.325; 8 -9.925,5.325 | smd 1.2 x 2: 9 9.2,4.175 | smd 2.1 x 2.4: M1 -13.4,-2 | smd 2.6 x 2.9: M2 13.4,-5.35 | smd 1.3 x 1.9: M3 -13.6,17.4; M4 13.8,16.95; M5 13.8,21.3 | smd 1.4 x 1.95: SW1 -11.9,22.7; SW3 -13.7,22.7 | smd 2.1 x 2.2: SW2 -13.4,-4.75 | hole 1.4: -11.9,0; 12.1,0
679105700 = smd 0.6 x 2: 1 0.4,-4.1; 2 1.1,4.1; 3 1.2,-4.1; 4 1.9,4.1; 5 2,-4.1; 6 2.7,4.1; 7 2.8,-4.1; 8 3.5,4.1; 9 3.6,-4.1; 10 4.3,4.1; 11 4.4,-4.1; 12 5.1,4.1; 13 5.2,-4.1; 14 5.9,4.1; 15 6,-4.1; 16 6.7,4.1; 17 10.3,-4.1; 18 10.7,4.1; 19 11.1,-4.1; 20 11.5,4.1; 21 11.9,-4.1; 22 12.3,4.1; 23 12.7,-4.1; 24 13.1,4.1; 25 13.5,-4.1; 26 13.9,4.1; 27 14.3,-4.1; 28 14.7,4.1; 29 15.1,-4.1; 30 15.5,4.1; 31 15.9,-4.1; 32 16.3,4.1; 33 16.7,-4.1; 34 17.1,4.1; 35 17.5,-4.1; 36 17.9,4.1; 37 18.3,-4.1; 38 18.7,4.1; 39 19.1,-4.1; 40 19.5,4.1; 41 19.9,-4.1; 42 20.3,4.1; 43 20.7,-4.1; 44 21.1,4.1; 45 21.5,-4.1; 46 21.9,4.1; 47 22.3,-4.1; 48 22.7,4.1; 49 23.1,-4.1; 50 23.5,4.1; 51 23.9,-4.1; 52 24.3,4.1 | smd 2.3 x 3.2: M1 27.15,-3.5; M2 -2.2,-3.5 | smd 4.8 x 3: M3 0.4,47.25; M4 0.4,53.55; M5 24.6,47.25; M6 24.6,53.55 | hole 1.6: 0,0; 0.4,50.4 | hole 1.1: 25,0; 24.6,50.4
XBEE-PRO = drill 0.8 pad 1.27: 1 -11,9; 2 -11,7; 3 -11,5; 4 -11,3; 5 -11,1; 6 -11,-1; 7 -11,-3; 8 -11,-5; 9 -11,-7; 10 -11,-9; 11 11,-9; 12 11,-7; 13 11,-5; 14 11,-3; 15 11,-1; 16 11,1; 17 11,3; 18 11,5; 19 11,7; 20 11,9

### Placement (x,y rotation side)
C1  28.41,22.4 0 top
C2  91.76,45.4 270 top
C3  29.56,15.51 90 top
C4  78.11,23.81 0 top
C5  30.8,93.98 270 top
C6  35.88,99.06 180 top
C7  77.47,13.97 0 top
C8  67.28,45.64 90 top
C9  28.26,99.06 0 top
C10  35.24,96.2 0 top
C11  29.21,93.98 270 top
C12  101.6,49.21 270 top
C13  101.6,46.04 270 top
C14  100.01,49.21 270 top
C15  100.01,46.04 270 top
C16  115.57,49.85 90 top
C17  100.33,34.92 0 top
C18  103.82,24.45 180 top
C19  100.33,36.51 0 top
C20  96.2,23.81 270 top
C21  117.47,34.92 0 top
C22  116.84,21.27 90 top
C23  117.47,36.51 0 top
C24  113.03,23.81 270 top
C25  95.25,51.12 90 top
C26  63.18,120.97 90 top
C27  57.78,120.97 90 top
C28  52.39,120.97 90 top
C29  46.99,120.97 90 top
C30  71.44,141.6 0 top
C31  75.56,141.6 180 top
D2  57.78,30.16 90 top
IC2  65.72,8.89 180 top
IC5  73.34,146.05 270 top
J1  50.8,91.76 270 top
L1  66.99,27.3 180 top
LED1  72.07,97.47 0 top
LED2  10.79,36.51 270 top
LED3  98.11,45.09 0 top
LED4  68.58,97.47 0 top
LED5  96.2,45.09 0 top
LED6  117.16,44.77 0 top
LED7  115.25,44.77 0 top
PTC1  74.93,4.76 270 top
Q1  78.11,33.66 0 top
Q2  99.69,28.57 270 top
Q3  116.84,28.57 270 top
Q7  68.58,137.79 0 top
R1  29.52,19.48 90 top
R2  68.58,93.03 270 top
R3  88.86,122.81 90 top
R4  101.39,122.81 90 top
R5  86.5,122.81 90 top
R6  103.12,122.81 90 top
R7  83.82,122.81 90 top
R8  15.24,36.51 180 top
R9  72.07,93.03 270 top
R10  61.59,17.46 0 top
R11  64.77,17.46 180 top
R12  77.15,30.16 90 top
R13  30.16,103.82 270 top
R14  79.06,30.16 90 top
R15  93.66,45.4 90 top
R16  89.85,45.4 90 top
R17  31.75,103.82 270 top
R18  33.34,103.82 90 top
R19  100.33,38.1 0 top
R20  98.11,41.59 90 top
R21  96.2,41.59 90 top
R22  117.47,38.1 0 top
R23  117.16,41.59 90 top
R24  115.25,41.59 90 top
R25  72.39,137.79 180 top
R26  64.77,140.34 0 top
R27  63.18,138.43 0 top
R63  65.72,137.48 90 top
TP1  33.97,124.78 90 top
TP2  26.67,124.78 90 top
TP3  19.37,124.78 90 top
TP4  12.06,124.78 90 top
U1  91.76,51.12 270 top
U2  31.75,97.79 90 top
U3  108.58,46.04 0 top
U$1  96.15,65.12 270 top
U$18  99.38,4.13 0 top
U$24  90.49,32.38 90 top
U$26  47.62,127.32 180 top
U$27  53.02,127.32 180 top
U$29  108.27,32.38 90 top
U$32  53.98,7.94 90 top
U$33  58.42,127.32 180 top
U$34  63.82,127.32 180 top
U$36  66.04,148.59 270 top
X1  93.06,148.64 180 top
X5  36.83,112.39 180 top
XB1  20.45,17.46 180 top

### Tracks (layer width: path | path; a pad name or v marks a point on that pad's centre or on a via)
3.3V  (via drill 0.38, 0.5, 0.7, 0.8)
  Top 0.406: X5.41 X5.39 17.73,119.97 19.37,121.6 TP3.P$1 | v83.82,120.97 R7.1 | R4.1 101.39,120.97 v101.28,120.97 | R3.1 88.86,120.97 v88.9,120.97 | R5.1 86.5,120.97 v86.36,120.97 | X1.4 93.86,145.93 94.3,146.37 104.14,146.37 104.46,146.05 104.46,129.54 106.76,127.24 X1.SW3 106.76,124.85 104.14,122.24 103.31,122.24 R6.1 103.12,120.97 v103.19,120.97 110.81,120.97 112.25,119.53 U$1.P$44 | U3.16 115.44,50.48 C16.2 115.7,50.48 117.79,50.48 118.24,50.04 R22.2 | v65.72,19.05 65.53,18.86 R11.1 | XB1.1 32.59,8.46 33.02,8.89 33.02,16.46 | XB1.5 29.74,16.46 C3.2 | C25.2 95.25,51.44 | R63.1 65.6,136.72 v64.77,135.89 | R19.2 102.68,39.69 v103.82,39.69
  Top 0.61: C8.P$1 56.6,46.04 U$32.P$16 | X5.52 12.53,110.64 14.61,112.71 16.83,112.71 | 16.83,112.71 33.34,112.71 35.56,110.49 35.88,110.49 | 35.88,110.49 40.32,110.49 | X5.2 35.73,110.34 35.88,110.49 | X5.41 16.93,112.81 16.83,112.71 | 40.32,110.49 41.91,108.9 79.06,108.9 93.54,94.42 U$1.P$44 U$1.P$43 | XB1.5 33.02,16.46 49.8,16.46 52.7,19.37 54.93,19.37 55.88,20.32 55.88,30.16 57.78,32.07 66.86,32.07 L1.2 73.88,32.2 76.33,34.66 Q1.3 78.15,34.61 80.64,34.61 81.28,33.97 81.28,32.7 83.5,30.48 U$24.17 89.22,30.48 v92.99,26.7 U$24.1 96.2,26.7 | U$29.1 113.03,26.7 | 113.03,26.7 110.45,26.7 106.5,30.66 v105.94,30.66 105.77,30.48 U$29.17 | C20.1 96.2,26.7 | 113.03,26.7 C24.1 112.2,24.57 110.17,22.54 v108.9,22.54 | U3.16 v107,50.48 106.05,51.44 95.25,51.44 91.44,51.44 91.12,51.75 U1.3 | v63.18,126.36 U$34.6 C26.2 | v52.39,126.36 U$27.6 C28.2 | v57.78,126.36 U$33.6 C27.2 | C29.2 U$26.6 v46.99,126.36 45.09,126.36 44.13,125.41 44.13,114.3 40.32,110.49 | 96.2,26.7 97.12,26.7 97.79,26.04 97.79,24.13 99.38,22.54 v105.73,22.54
  Top 1.016: C8.P$1 66.99,35.65 L1.2 67.93,32.2 C4.+
  Bottom 0.406: v103.19,120.97 v101.28,120.97 v88.9,120.97 v86.36,120.97 v83.82,120.97 | C4.+ 71.56,19.05 v65.72,19.05 | v64.77,135.89 47.94,135.89 46.35,134.3 46.35,129.86 46.04,129.54 46.04,128.91 46.99,127.95 v46.99,126.36 | v103.82,39.69 105.94,39.69
  Bottom 0.61: v105.94,30.66 105.94,39.69 105.94,49.43 v107,50.48 107,56.52 117.47,66.99 117.47,91.73 U$1.P$43 | v46.99,126.36 v52.39,126.36 v57.78,126.36 v63.18,126.36 | v105.73,22.54 v108.9,22.54
5.0V
  Top 0.406: R25.1 73.98,137.79 74.61,138.43 74.61,141.54 C31.2 | U$36.2 48.85,147.59 27.3,126.05 TP2.P$1 26.99,125.09 26.99,125.73
  Top 0.61: C31.2 74.55,144.53 73.05,146.03 IC5.2 69.85,146.37 69.53,146.37 68.31,147.59 U$36.2
12V  (via drill 0.6, 0.8)
  Top 0.406: C7.+ 78.11,17.14 78.11,26.67 77.15,27.62 R12.1 | 33.97,125.73 TP1.P$1 34.92,126.36 v43.5,134.94
  Top 0.61: IC5.3 71.84,143.74 72.45,143.13 C30.2 72.45,139.45 v72.39,139.38 | v81.28,70.17 82.55,71.44 v82.55,103.19
  Top 1.016: IC2.1 69.22,14.59 69.22,13.97 C7.+ PTC1.P$1
  Bottom 0.406: v72.39,139.38 47.94,139.38 v43.5,134.94
  Bottom 0.61: v81.28,70.17 78.11,66.99 78.11,17.14 C7.+ | v82.55,103.19 82.55,114.94 72.39,125.09 v72.39,139.38
COMD+
  Top 0.406: U$18.10 100.76,19.26 99.06,20.95 94.61,20.95 92.08,23.5 92.08,24.77 88.9,27.94 U$24.19
COMD-
  Top 0.406: U$18.3 99.45,21.59 94.93,21.59 92.71,23.81 92.71,25.08 88.58,29.21 U$24.18
COMRX
  Top 0.406: U$1.P$22 110.17,65.06 110.17,63.18 108.27,61.28 94.93,61.28 87.31,53.66 87.31,44.13 93.34,38.1 U$24.10
COMTX
  Top 0.406: U$1.P$21 106.92,61.91 94.61,61.91 86.68,53.98 86.68,43.18 88.27,41.59 88.27,37.47 87.63,36.83 U$24.12
CS1  (via drill 0.38)
  Top 0.406: U$26.4 45.72,132.08 47.94,134.3 67.63,134.3 70.17,131.76 70.17,110.81 v71.12,109.86
  Bottom 0.406: v71.12,109.86 71.12,107.95 73.95,105.12 U$1.P$51
CS2  (via drill 0.38)
  Top 0.406: U$27.4 51.12,132.08 52.7,133.67 67.31,133.67 69.53,131.44 69.53,110.17 v69.85,109.86
  Bottom 0.406: v69.85,109.86 69.85,107.95 73.98,103.82 76.37,103.82 U$1.P$52
CS3  (via drill 0.38)
  Top 0.406: U$33.4 56.52,132.08 57.47,133.03 66.99,133.03 68.9,131.13 68.9,110.17 v68.58,109.86
  Bottom 0.406: v68.58,109.86 68.58,107.95 73.95,102.58 U$1.P$53
CS4  (via drill 0.38)
  Top 0.406: U$34.4 61.91,132.08 62.23,132.4 66.67,132.4 68.26,130.81 68.26,110.81 v67.31,109.86
  Bottom 0.406: v67.31,109.86 67.31,107.95 73.98,101.28 76.37,101.28 U$1.P$54
CTS-XBEE
  Bottom 0.406: XB1.12 15.88,24.46 23.5,32.07 23.5,46.67 32.07,55.24 58.92,55.24 U$1.P$77
DEBUG-LED1
  Top 0.406: U$1.P$64 77.67,90.29 76.83,91.12 73.22,91.12 R9.2
DEBUG-LED2
  Top 0.406: U$1.P$66 76.52,87.84 76.52,89.53 75.56,90.49 70.36,90.49 R2.2
ECU_CAN_H  (via drill 0.38)
  Top 0.406: U1.7 92.39,47.43 R15.2 94.49,46.16 v94.61,46.04
  Bottom 0.406: v94.61,46.04 94.61,41.91 94.96,41.57 arc90 95.91,41.57 96.1,41.76 arc-90 97.05,41.76 97.1,41.72 arc-90 97.1,40.76 96.91,40.57 arc90 96.91,39.62 96.95,39.57 arc90 97.9,39.57 98.1,39.77 arc-90 99.05,39.77 99.09,39.72 arc-90 99.09,38.77 98.9,38.58 arc90 98.9,37.62 103.76,32.77 103.76,22.61 106.68,19.68 106.68,18.1 104.87,16.29 U$18.9
ECU_CAN_L  (via drill 0.38)
  Top 0.406: U1.6 91.12,47.43 R16.2 89.72,46.04 v88.9,46.04
  Bottom 0.406: v88.9,46.04 93.34,41.59 93.98,41.59 102.87,32.7 102.87,20.64 103.82,19.68 103.82,18.1 103.5,17.78 103.19,17.78 102.23,16.83 102.23,14.81 U$18.15
ECU_CAN_RX
  Top 0.406: U$1.P$23 113.64,70.17 111.44,70.17 111.12,69.85 111.12,68.26 111.44,67.94 111.44,62.23 109.86,60.64 95.57,60.64 89.85,54.93 U1.4
ECU_CAN_TX
  Top 0.406: U$1.P$24 112.25,62.08 110.17,60.01 96.2,60.01 93.66,57.47 U1.1
ECUD+
  Top 0.406: U$18.8 106.76,27.23 106.05,27.94 U$29.19
ECUD-
  Top 0.406: U$29.18 105.73,29.21 107.63,27.3 107.63,19.41 U$18.1
ECURX
  Top 0.406: U$29.10 113.2,41.51 U3.9
ECUTX
  Top 0.406: U3.10 111.12,42.86 105.09,36.83 U$29.12
GND  (via drill 0.38)
  other vias: 105.73,24.45 97.47,22.86 70.48,140.34 66.99,141.29
  pour Bottom: 119.06,159.7 119.06,0 7.94,0 7.94,159.7
  pour Top: 119.06,159.7 119.06,0 7.94,0 7.94,159.7
GPS_RX  (via drill 0.38)
  Top 0.406: R26.1 64.01,138.49 R27.2 64.14,138.24 64.14,136.53 63.82,136.21 63.82,135.57 64.45,134.94 v75.25,134.94
  Bottom 0.406: U$1.P$36 106.56,84.26 95.25,95.57 95.25,106.05 75.88,125.41 75.88,134.3 v75.25,134.94
GPS_TX  (via drill 0.38)
  Top 0.406: Q7.2 76.25,136.79 v76.52,136.53
  Bottom 0.406: U$1.P$35 113.64,85.41 106.36,85.41 95.89,95.89 95.89,106.36 76.52,125.73 v76.52,136.53
MISO  (via drill 0.38)
  Top 0.406: U$26.8 v49.53,125.41 | v65.72,125.41 U$34.8 | U$27.8 v54.93,125.41 | U$33.8 v60.33,125.41
  Bottom 0.406: v49.53,125.41 v54.93,125.41 v60.33,125.41 v65.72,125.41 67.94,125.41 79.69,113.67 79.69,75.25 85.99,68.95 U$1.P$4
MOSI  (via drill 0.38)
  Top 0.406: U$26.1 v49.53,127.32 | v65.72,127.32 U$34.1 | U$27.1 v54.93,127.32 | U$33.1 v60.33,127.32
  Bottom 0.406: v49.53,127.32 v54.93,127.32 v60.33,127.32 v65.72,127.32 66.99,127.32 80.33,113.98 80.33,75.56 87.31,68.58 87.31,65.06 U$1.P$5
N$1
  Top 0.406: IC2.4 64.02,17.45 R11.2 R10.2
N$2
  Top 0.406: XB1.6 29.78,18.46 R1.1
N$3
  Top 0.406: R2.1 LED4.A
N$4
  Top 1.016: IC2.2 67.42,21.97 L1.1 66.86,22.54 D2.C
N$5
  Top 0.406: LED2.A 8.26,35.47 8.26,19.65 XB1.15
N$6
  Top 0.406: LED2.C R8.2
N$7
  Top 0.406: R9.1 LED1.A
N$8
  Top 0.406: U3.4 101.73,46.67 C13.1
N$9
  Top 0.406: U3.3 102.11,47.94 C12.2
N$10
  Top 0.406: U3.1 102.11,50.48 C12.1
N$13
  Top 0.406: U3.6 101.16,44.13 C15.2
N$14
  Top 0.406: R14.2 R12.2 Q1.1
N$15
  Top 0.305: U3.2 100.78,49.21 C14.1
N$16  (via drill 0.38)
  Top 0.406: R13.2 v30.16,101.92 30.8,101.28 30.8,98.97 | 30.8,98.97 U2.6 | v49.53,101.92 J1.C2 | 30.8,98.97 29.11,98.97 C9.2
  Bottom 0.406: v30.16,101.92 v49.53,101.92
N$17  (via drill 0.38)
  Top 0.406: R17.2 31.75,102.55 32.7,101.6 v32.7,100.97 32.7,98.97 U2.4 | v52.07,100.97 J1.C3 | C6.2 35.12,99.82 v34.92,100.01
  Bottom 0.406: v32.7,100.97 34.92,100.97 | 34.92,100.97 v52.07,100.97 | v34.92,100.01 34.92,100.97
N$18
  Top 0.406: R18.1 33.34,102.55 33.66,102.23 33.66,98.11 33.34,97.79 33.02,97.79 32.7,97.47 32.7,96.63 U2.3 | U2.3 32.69,81.93 33.34,81.28 51.75,81.28 52.07,80.96 J1.C7 | C10.1 32.69,96.2 U2.3
N$19  (via drill 0.38)
  Top 0.406: C11.1 C5.1 30.81,94.75 U2.1 30.71,96.52 v29.21,96.52 | X5.8 v33.33,106.05 v33.34,106.05 46.67,106.05 46.99,105.73 J1.C1
  Bottom 0.406: v33.34,106.05 29.53,106.05 29.21,105.73 v29.21,96.52
N$20
  Top 0.406: U3.5 101.73,45.4 C13.2
N$21
  Top 0.406: C2.1 91.76,49.85 91.44,50.16 90.17,50.16 89.85,49.85 U1.5 | R15.1 93.37,44.64 C2.1 | R16.1 90.14,44.64 C2.1
N$22
  Top 0.406: X5.10 32.53,105.39 R18.2
N$23
  Top 0.406: X5.14 30.93,105.35 R13.1
N$24
  Top 0.406: X5.12 31.73,104.61 R17.1
N$25
  Top 0.406: C22.2 Q3.2 115.06,27.94 U$29.2
N$26
  Top 0.406: C18.2 101.41,24.45 Q2.2 97.92,27.94 U$24.2
N$27
  Top 0.406: C17.1 99.69,34.8 Q2.1 97.92,29.21 U$24.3
N$28
  Top 0.406: C21.1 116.84,34.8 Q3.1 115.06,29.21 U$29.3
N$29
  Top 0.406: R21.1 96.2,40.01 96.52,39.69 97.16,39.69 97.47,39.37 97.47,33.66 96.84,33.02 U$24.6
N$36
  Top 0.406: R20.1 98.11,33.02 96.84,31.75 U$24.5
N$43
  Top 0.406: R19.1 C19.1 99.38,36.51 98.74,35.88 98.74,32.07 97.16,30.48 U$24.4
N$44  (via drill 0.38)
  Top 0.406: U$29.6 111.44,33.02 111.12,33.34 111.12,38.73 v112.08,39.69 | v114.62,39.69 115.25,40.32 R24.1
  Bottom 0.406: v112.08,39.69 v114.62,39.69
N$45
  Top 0.406: U$29.5 114.62,31.75 114.94,32.07 114.94,37.78 117.16,40.01 R23.1
N$46
  Top 0.406: R20.2 LED3.A
N$47
  Top 0.406: R21.2 LED5.A
N$48
  Top 0.406: R22.1 C23.1 115.57,35.37 115.57,31.11 114.94,30.48 U$29.4
N$55
  Top 0.406: R23.2 LED6.A
N$56
  Top 0.406: R24.2 LED7.A
N$58
  Top 0.406: Q7.1 67.63,137.16 66.67,138.11 65.85,138.11 R63.2
RESET  (via drill 0.38)
  Top 0.406: U$26.3 v46.99,129.22 | U$34.3 v63.18,129.22 63.18,127.95 64.77,126.36 66.36,126.36 67.31,125.41 v67.31,124.46 | U$27.3 v52.39,129.22 | U$33.3 v57.78,129.22
  Bottom 0.406: v46.99,129.22 v52.39,129.22 v57.78,129.22 v63.18,129.22 | v67.31,124.46 67.94,124.46 79.06,113.35 79.06,109.05 U$1.P$50
RS232RX  (via drill 0.38)
  Top 0.406: v107.31,41.59 U3.8
  Bottom 0.406: U$18.14 108.86,13.29 109.86,14.29 109.86,21.91 110.17,22.23 110.17,22.86 109.86,23.18 109.86,39.05 v107.31,41.59
RS232TX  (via drill 0.38)
  Top 0.406: v107.31,42.86 U3.7
  Bottom 0.406: U$18.20 110.81,13.34 110.81,39.37 v107.31,42.86
RTS-XBEE
  Bottom 0.406: XB1.16 10.43,16.46 10.79,16.83 10.79,22.86 11.75,23.81 16.19,23.81 24.13,31.75 24.13,46.35 32.38,54.61 59.37,54.61 74.93,70.17 78.42,70.17 79.06,70.8 79.06,75.14 U$1.P$74
RX-XBEE  (via drill 0.38)
  Top 0.406: U$1.P$76 76.38,72.71 72.39,72.71 55.24,55.56 55.24,49.85 U$32.P$17 | X5.11 32.43,114.89 v32.7,114.62
  Bottom 0.406: U$1.P$76 76.41,75.25 72.07,75.25 71.75,75.56 71.75,83.82 51.75,103.82 42.86,103.82 32.7,113.98 v32.7,114.62 | U$32.P$17 42.23,48.58 40.64,46.99 40.64,17.14 33.95,10.46 XB1.2
RXD1
  Top 0.406: U$36.4 67.45,145.59 67.94,145.1 67.94,140.65 67.63,140.34 R26.2
SCK  (via drill 0.38)
  Top 0.406: U$26.2 v48.26,128.27 | v64.45,128.27 U$34.2 | U$27.2 v53.66,128.27 | U$33.2 v59.05,128.27 | v87.31,69.85 87.31,65.17 U$1.P$3
  Bottom 0.406: v48.26,128.27 v53.66,128.27 v59.05,128.27 v64.45,128.27 66.99,128.27 80.96,114.3 80.96,75.88 87,69.85 v87.31,69.85
SD_IN  (via drill 0.38)
  Top 0.406: X1.SW1 104.78,125.76 v104.78,124.46
  Bottom 0.406: v104.78,124.46 104.78,94.93 109.22,90.49 113.64,90.49 U$1.P$39
SDIO_CMD
  Top 0.406: X1.2 R3.2 | R3.2 | R3.2 87.95,122.66 87.95,115.89 82.26,110.2 U$1.P$48
SDIO_D0  (via drill 0.38)
  Top 0.406: X1.7 101.36,123.57 R4.2 100.33,122.51 v100.33,119.38
  Bottom 0.406: v100.33,119.38 100.33,93.34 105.73,87.95 113.64,87.95 U$1.P$37
SDIO_D1  (via drill 0.38)
  Top 0.406: X1.8 102.98,123.57 R6.2 102.23,122.69 v102.23,119.38 | v110.17,88.9 112.25,86.83 U$1.P$38
  Bottom 0.406: v102.23,119.38 102.23,93.34 106.24,89.34 109.73,89.34 v110.17,88.9
SDIO_D2
  Top 0.406: X1.9 83.86,123.57 R7.2 82.87,122.62 82.87,116.52 80.96,114.62 77.01,114.62 U$1.P$45
SDIO_D3
  Top 0.406: X1.1 86.36,123.57 | 86.36,123.57 R5.2 | 86.36,123.57 85.09,122.3 85.09,116.84 80.99,112.74 U$1.P$46
SDIO_SCK  (via drill 0.38)
  Top 0.406: X1.5 96.36,140.17 v96.2,140.02 | v82.23,140.02 82.23,116.84 80.64,115.25 75.88,115.25 73.98,113.35 73.98,111.36 U$1.P$47
  Bottom 0.406: v96.2,140.02 v82.23,140.02
SS-XBEE
  Top 0.406: R1.2 29.52,22.31 C1.2 29.43,36.1 40.64,47.31 54.93,47.31 57.78,50.16 57.78,52.39 69.24,63.85 U$1.P$1
TX-XBEE  (via drill 0.38)
  Top 0.406: U$1.P$75 72.4,73.99 53.98,55.56 U$32.P$18 | X5.13 31.63,114.81 v31.43,114.62
  Bottom 0.406: U$1.P$75 72.06,73.99 71.12,74.93 71.12,83.19 51.12,103.19 42.23,103.19 31.43,113.98 v31.43,114.62 | U$32.P$18 43.81,51.12 40.01,47.31 40.01,17.46 35,12.46 XB1.3
TXD1
  Top 0.406: R25.2 71.12,137.79 70.12,138.79 Q7.3 68.58,146.05 68.04,146.59 U$36.3
V-SENSE  (via drill 0.38)
  Top 0.406: Q1.2 80.06,32.66 v80.33,32.38 | v80.33,35.56 80.33,48.58 94.3,62.55 94.85,62.55 U$1.P$11
  Bottom 0.406: v80.33,32.38 v80.33,35.56
VCC
  Top 1.016: U$18.26 79.69,10.79 78.11,9.21 78.11,3.49 77.28,2.66 PTC1.P$2
WP  (via drill 0.38)
  Top 0.406: U$26.5 v45.72,122.24 | v61.91,122.24 U$34.5 | U$33.5 v56.52,122.24 | U$27.5 v51.12,122.24
  Bottom 0.406: v45.72,122.24 v51.12,122.24 v56.52,122.24 v61.91,122.24 69.22,122.24 76.52,114.94 76.52,109.05 U$1.P$49

### Text on the board
tSilk: GND | 3.3V | 5V | 12V
_tsilk: Communication node / Version 2